# Altium schematic sheet 78l06.SchDoc
size A4
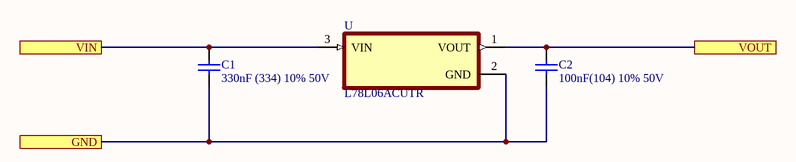
[diagram p0: 78l06.SchDoc]

## Parts
C1  330nF (334) 10% 50V  [0805_C]
C2  100nF(104) 10% 50V  [0805_C]
U  L78L06ACUTR  [VREG_L78L12ABUTR]

## Ports
GND, VIN, VOUT

## Nets
GND: C1.1 C2.1 U.2(GND) ; port GND
VIN: C1.2 U.3(VIN) ; port VIN
VOUT: C2.2 U.1(VOUT) ; port VOUT

## Library data of the parts
C1 = 0805 330nF (334) 10% 50V: 贴片电容; ComponentLink1Description: 供应商链接; ComponentLink1URL: http://www.szlcsc.com/product/details_2092.html; Package: 0805; Supplier: LC; SuppliersPartNumber: C1740
C2 = 0805 100nF(104) 10% 50V: 贴片电容; ComponentLink1Description: 供应商链接; ComponentLink1URL: http://www.szlcsc.com/product/details_50686.html; Package: 0805; Supplier: LC; SuppliersPartNumber: C49678
U = L78L06ACUTR: Linear Voltage Regulator IC 1 Output 100mA SOT-89-3; MF: STMicroelectronics; Package: SOT-89-3 STMicroelectronics; MP: L78L06ACUTR; Value: *; SnapEDA_Link: https://www.snapeda.com/parts/L78L06ACUTR/STMicroelectronics/view-part/1221968/?ref=snap; Availability: Unavailable; Price: None; DigiKey-Purchase-URL: https://snapeda.com/shop?store=DigiKey&id=1221968